# EasyEDA Pro project ProPrj_E24_5.0.epro, schematic 5.0

## Sheets
1 P1: Board Name: 5.0; Create Date: 2026-01-15; Page Name: P1; Project Name: E24_5.0; Schematic Name: 5.0; Update Date: 2026-01-15; Company: 嘉立创EDA; Page Size: A4; Version: V1.0
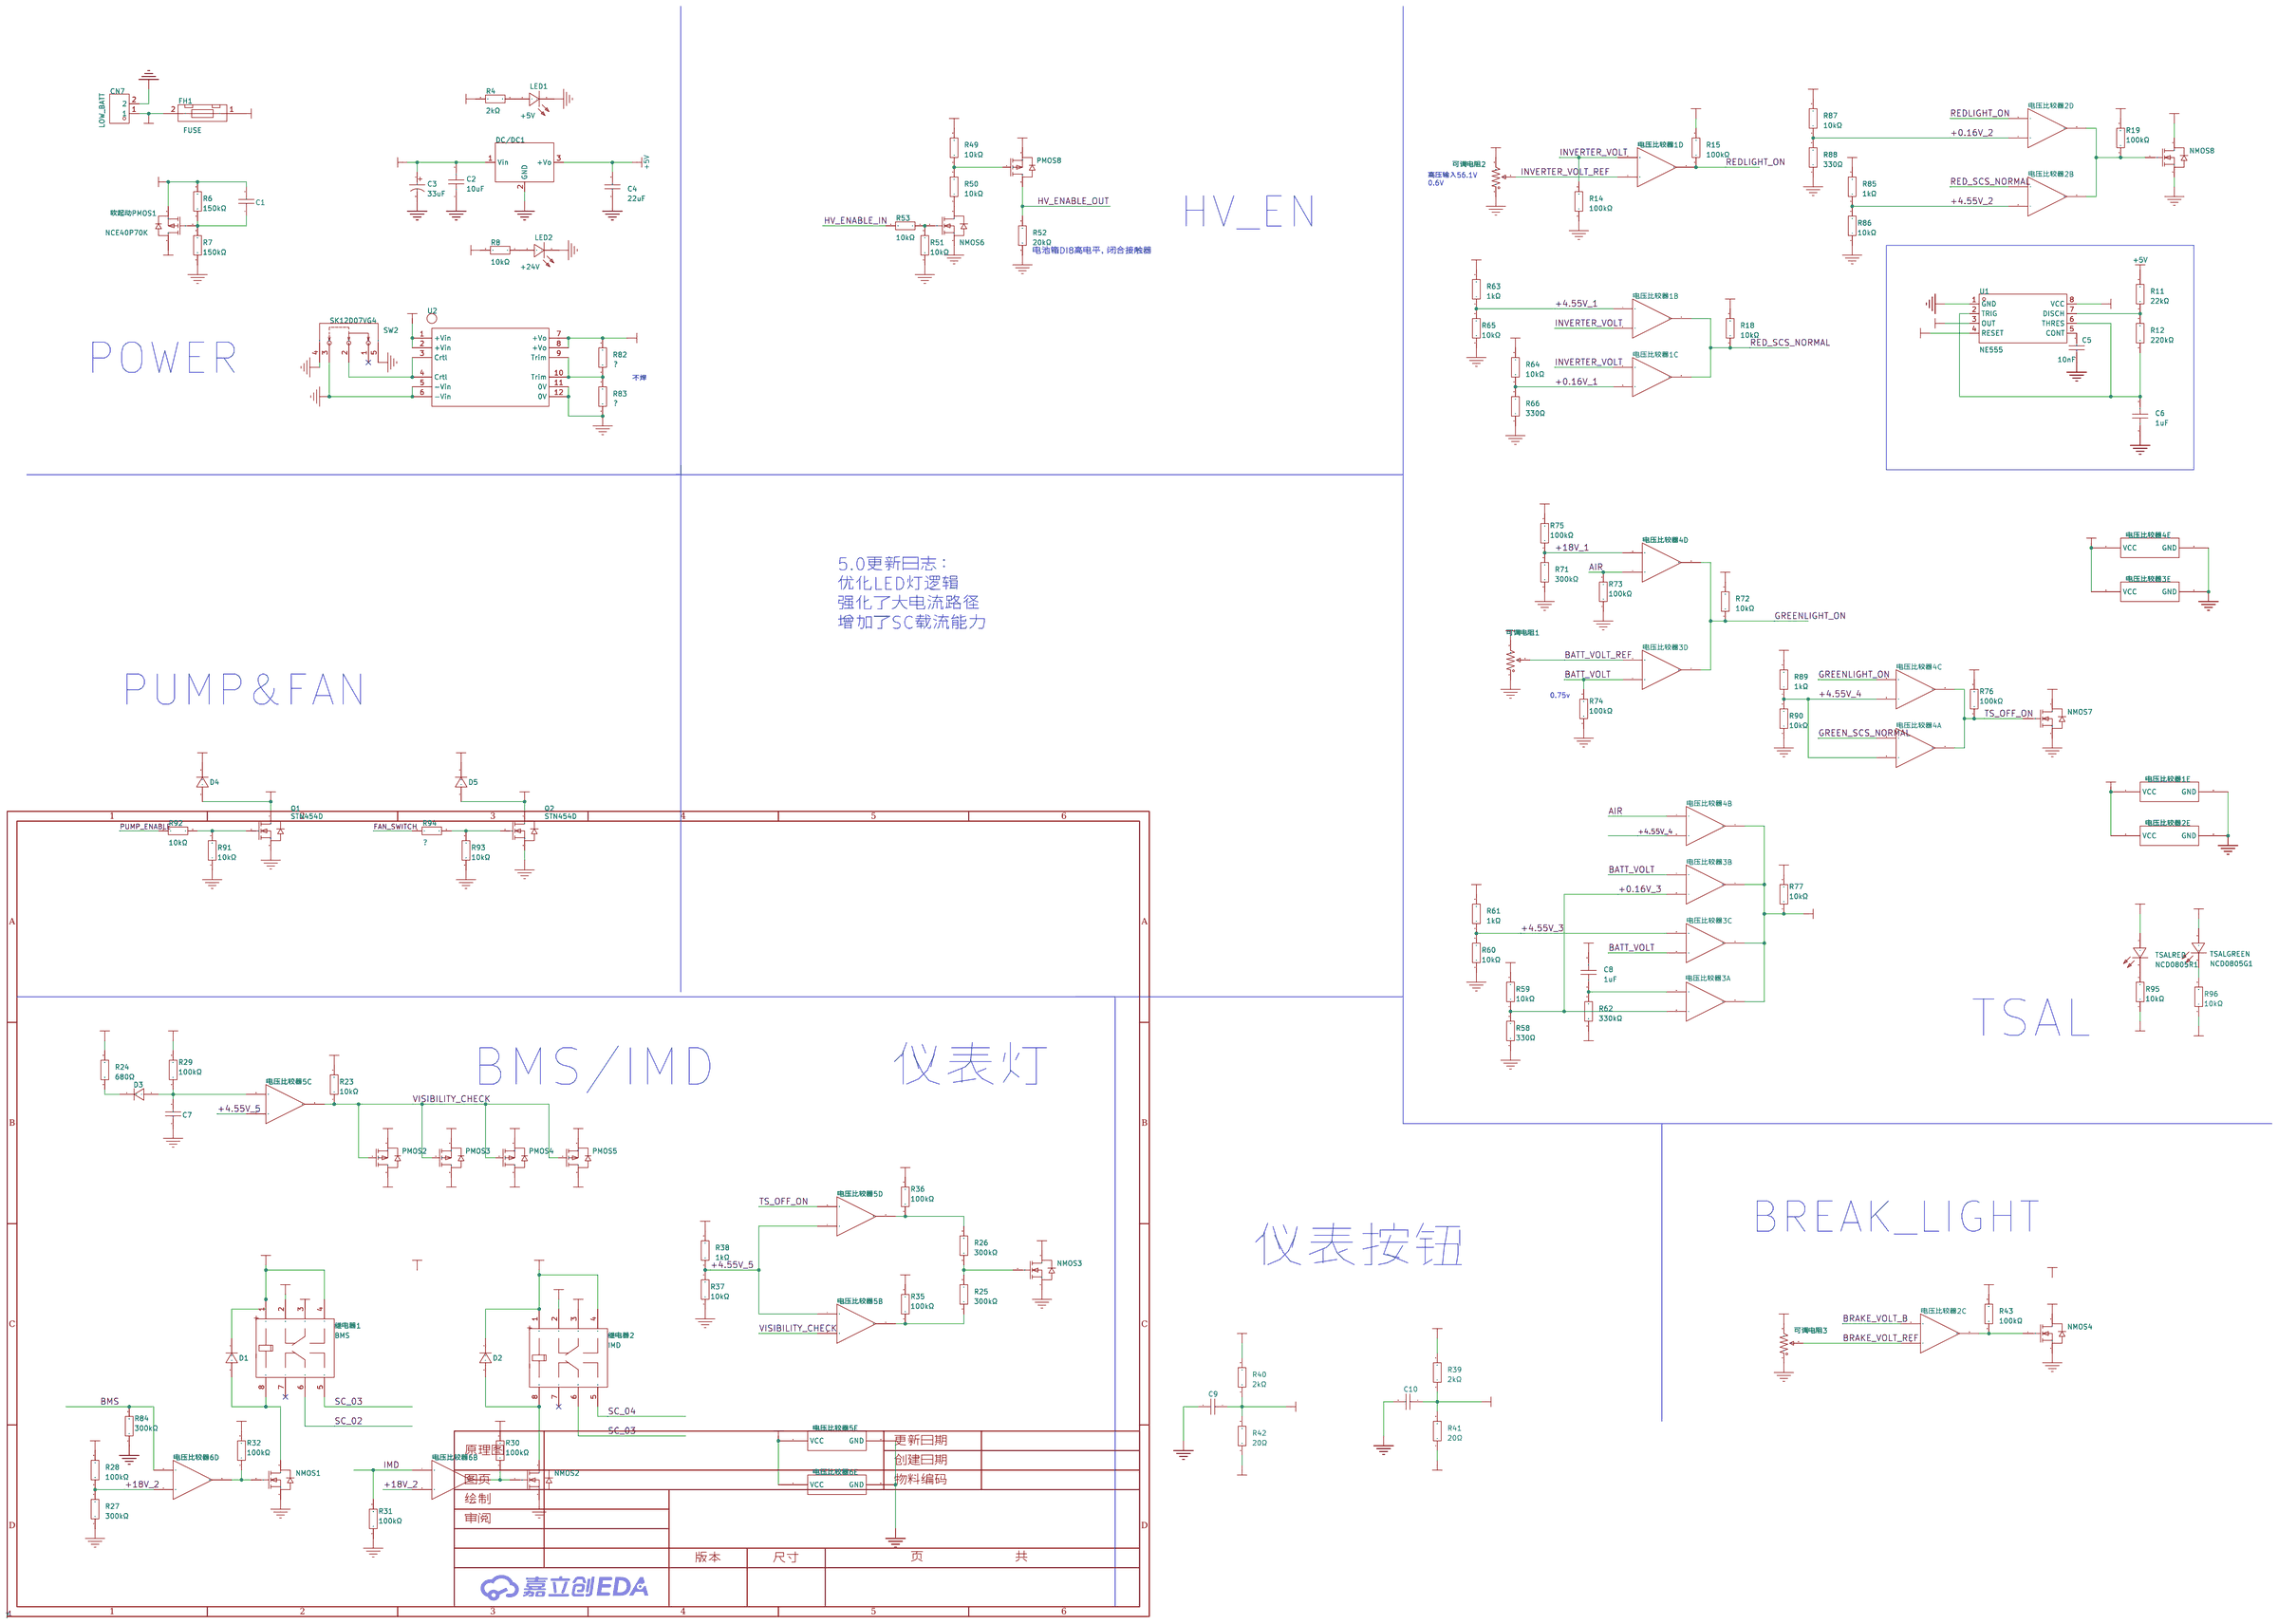
[diagram p0: P1]
2 P2: Create Date: 2025-09-20; Page Name: P2; Project Name: LV_E24; Schematic Name: 4.0_1; Update Date: 2025-09-20
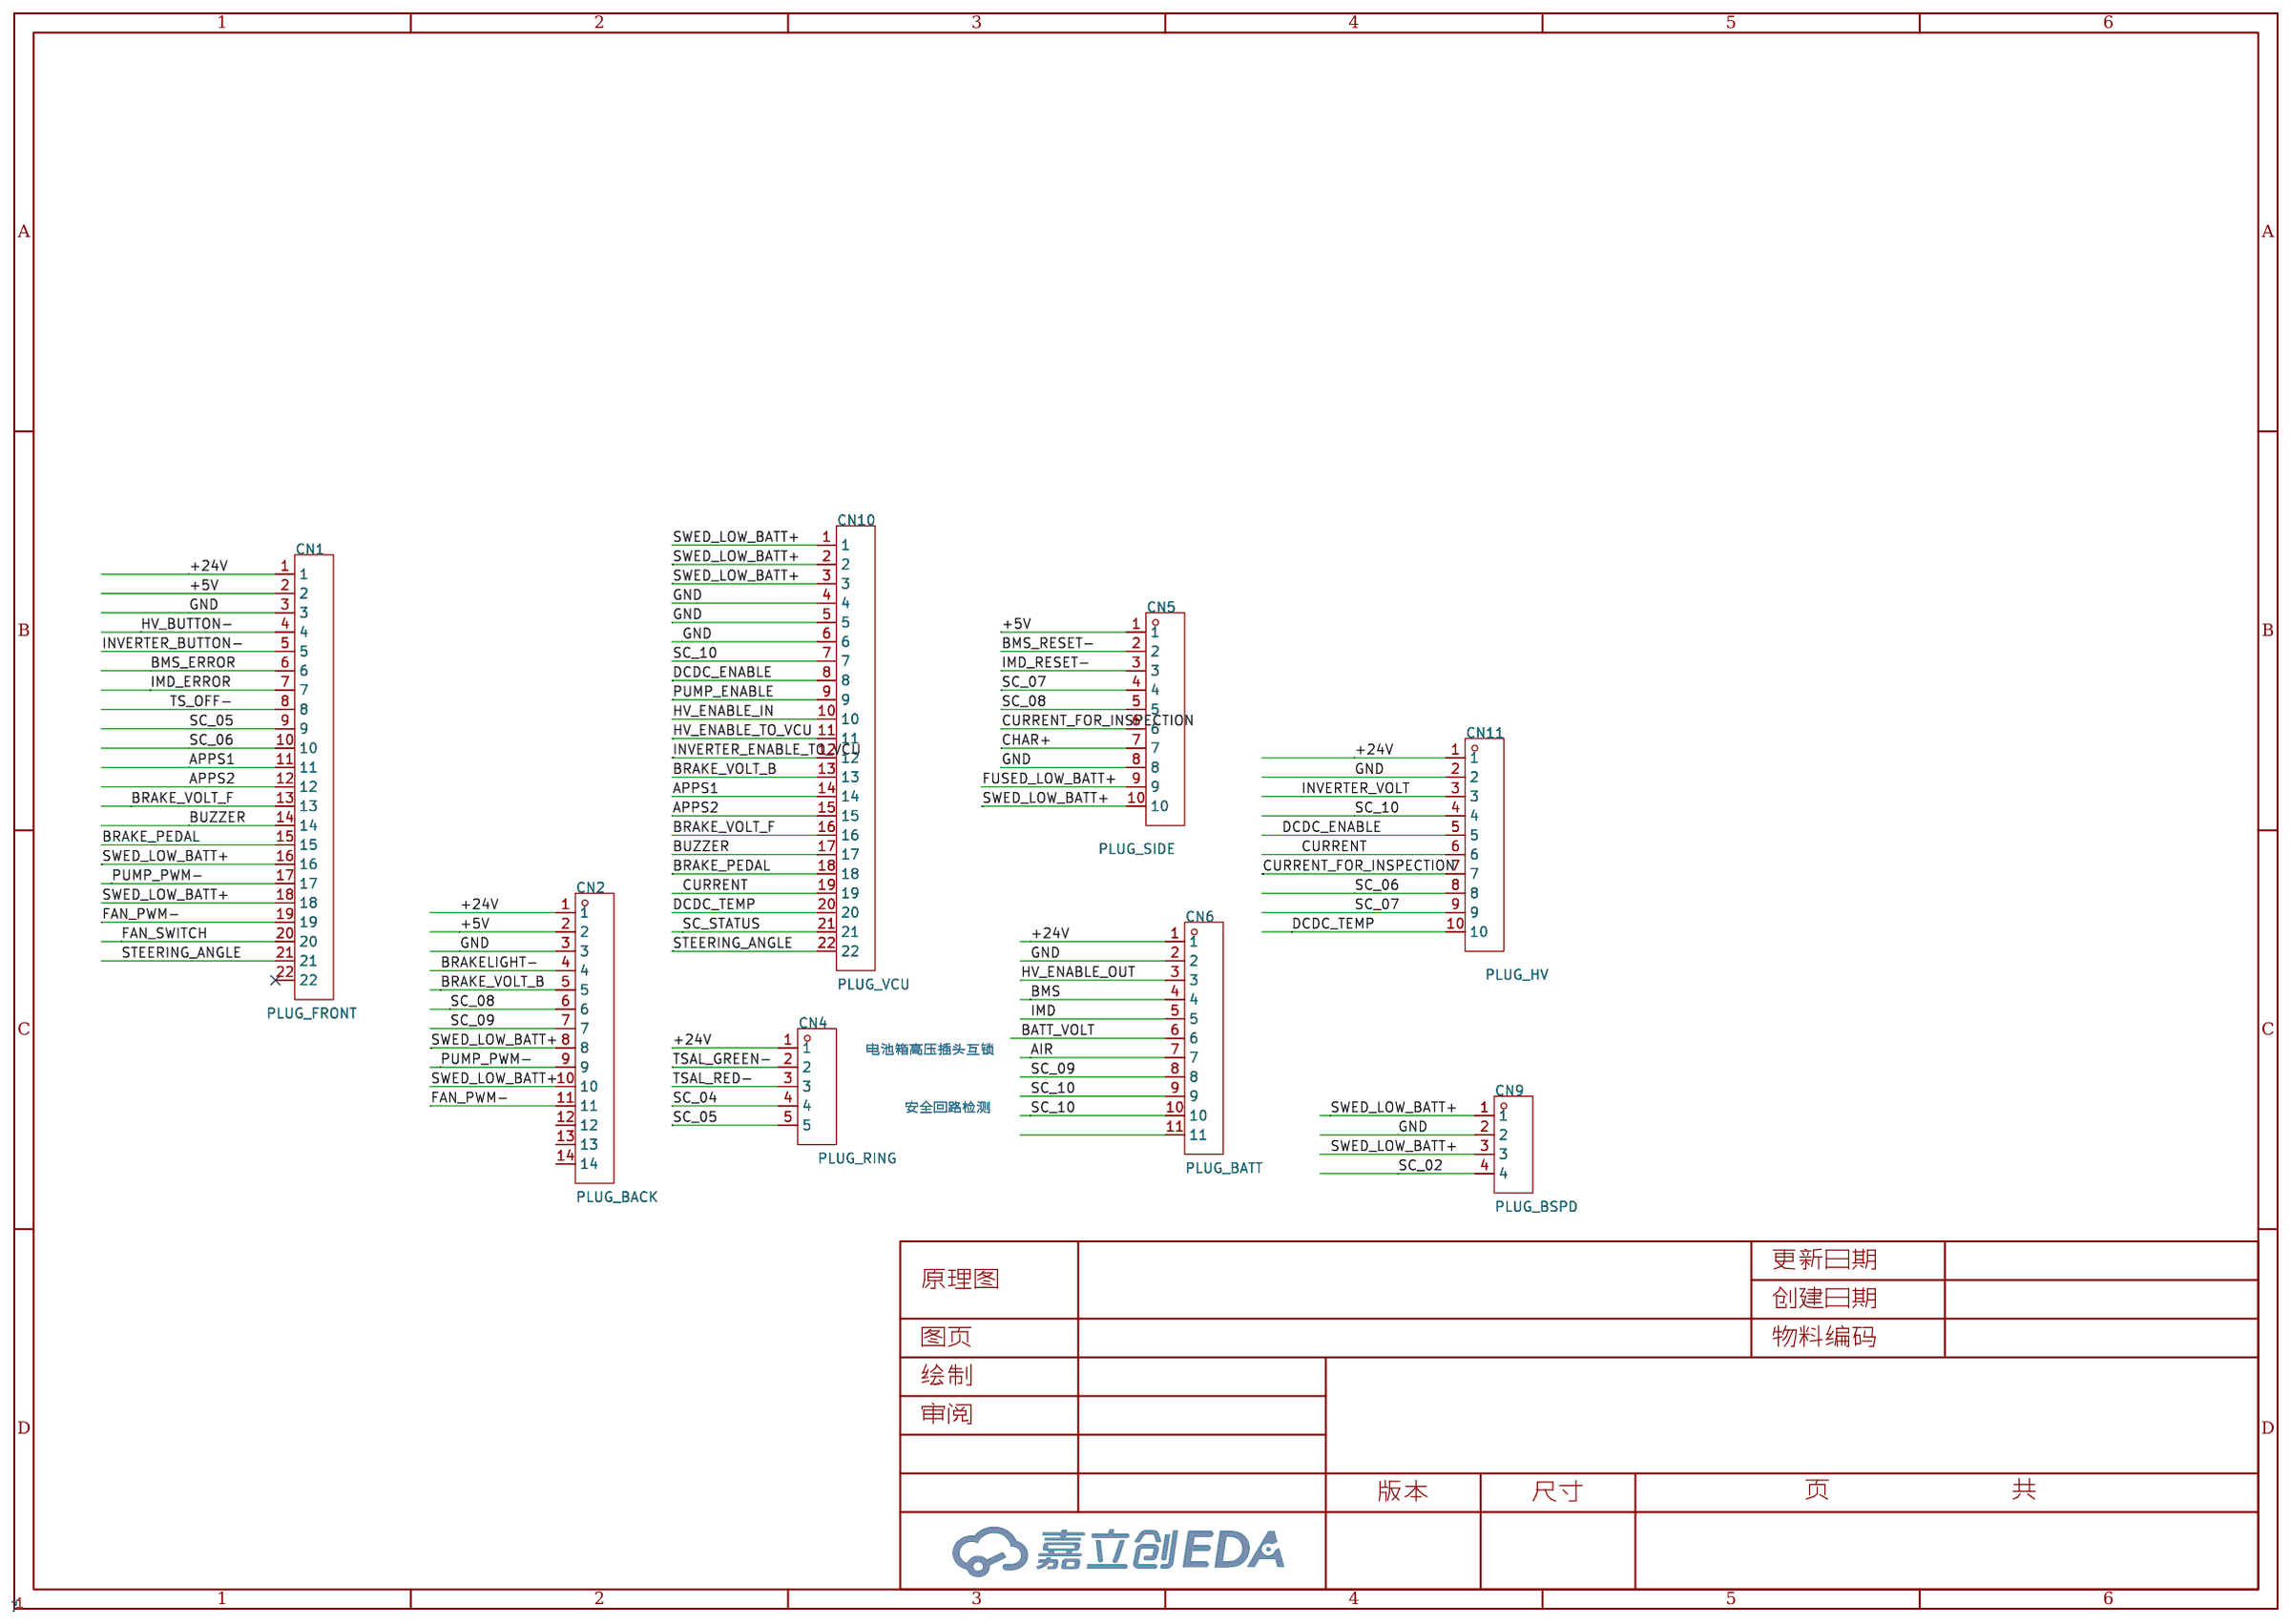
[diagram p1: P2]
3 P3: Create Date: 2025-09-20; Page Name: P3; Project Name: LV_E24; Update Date: 2025-10-22
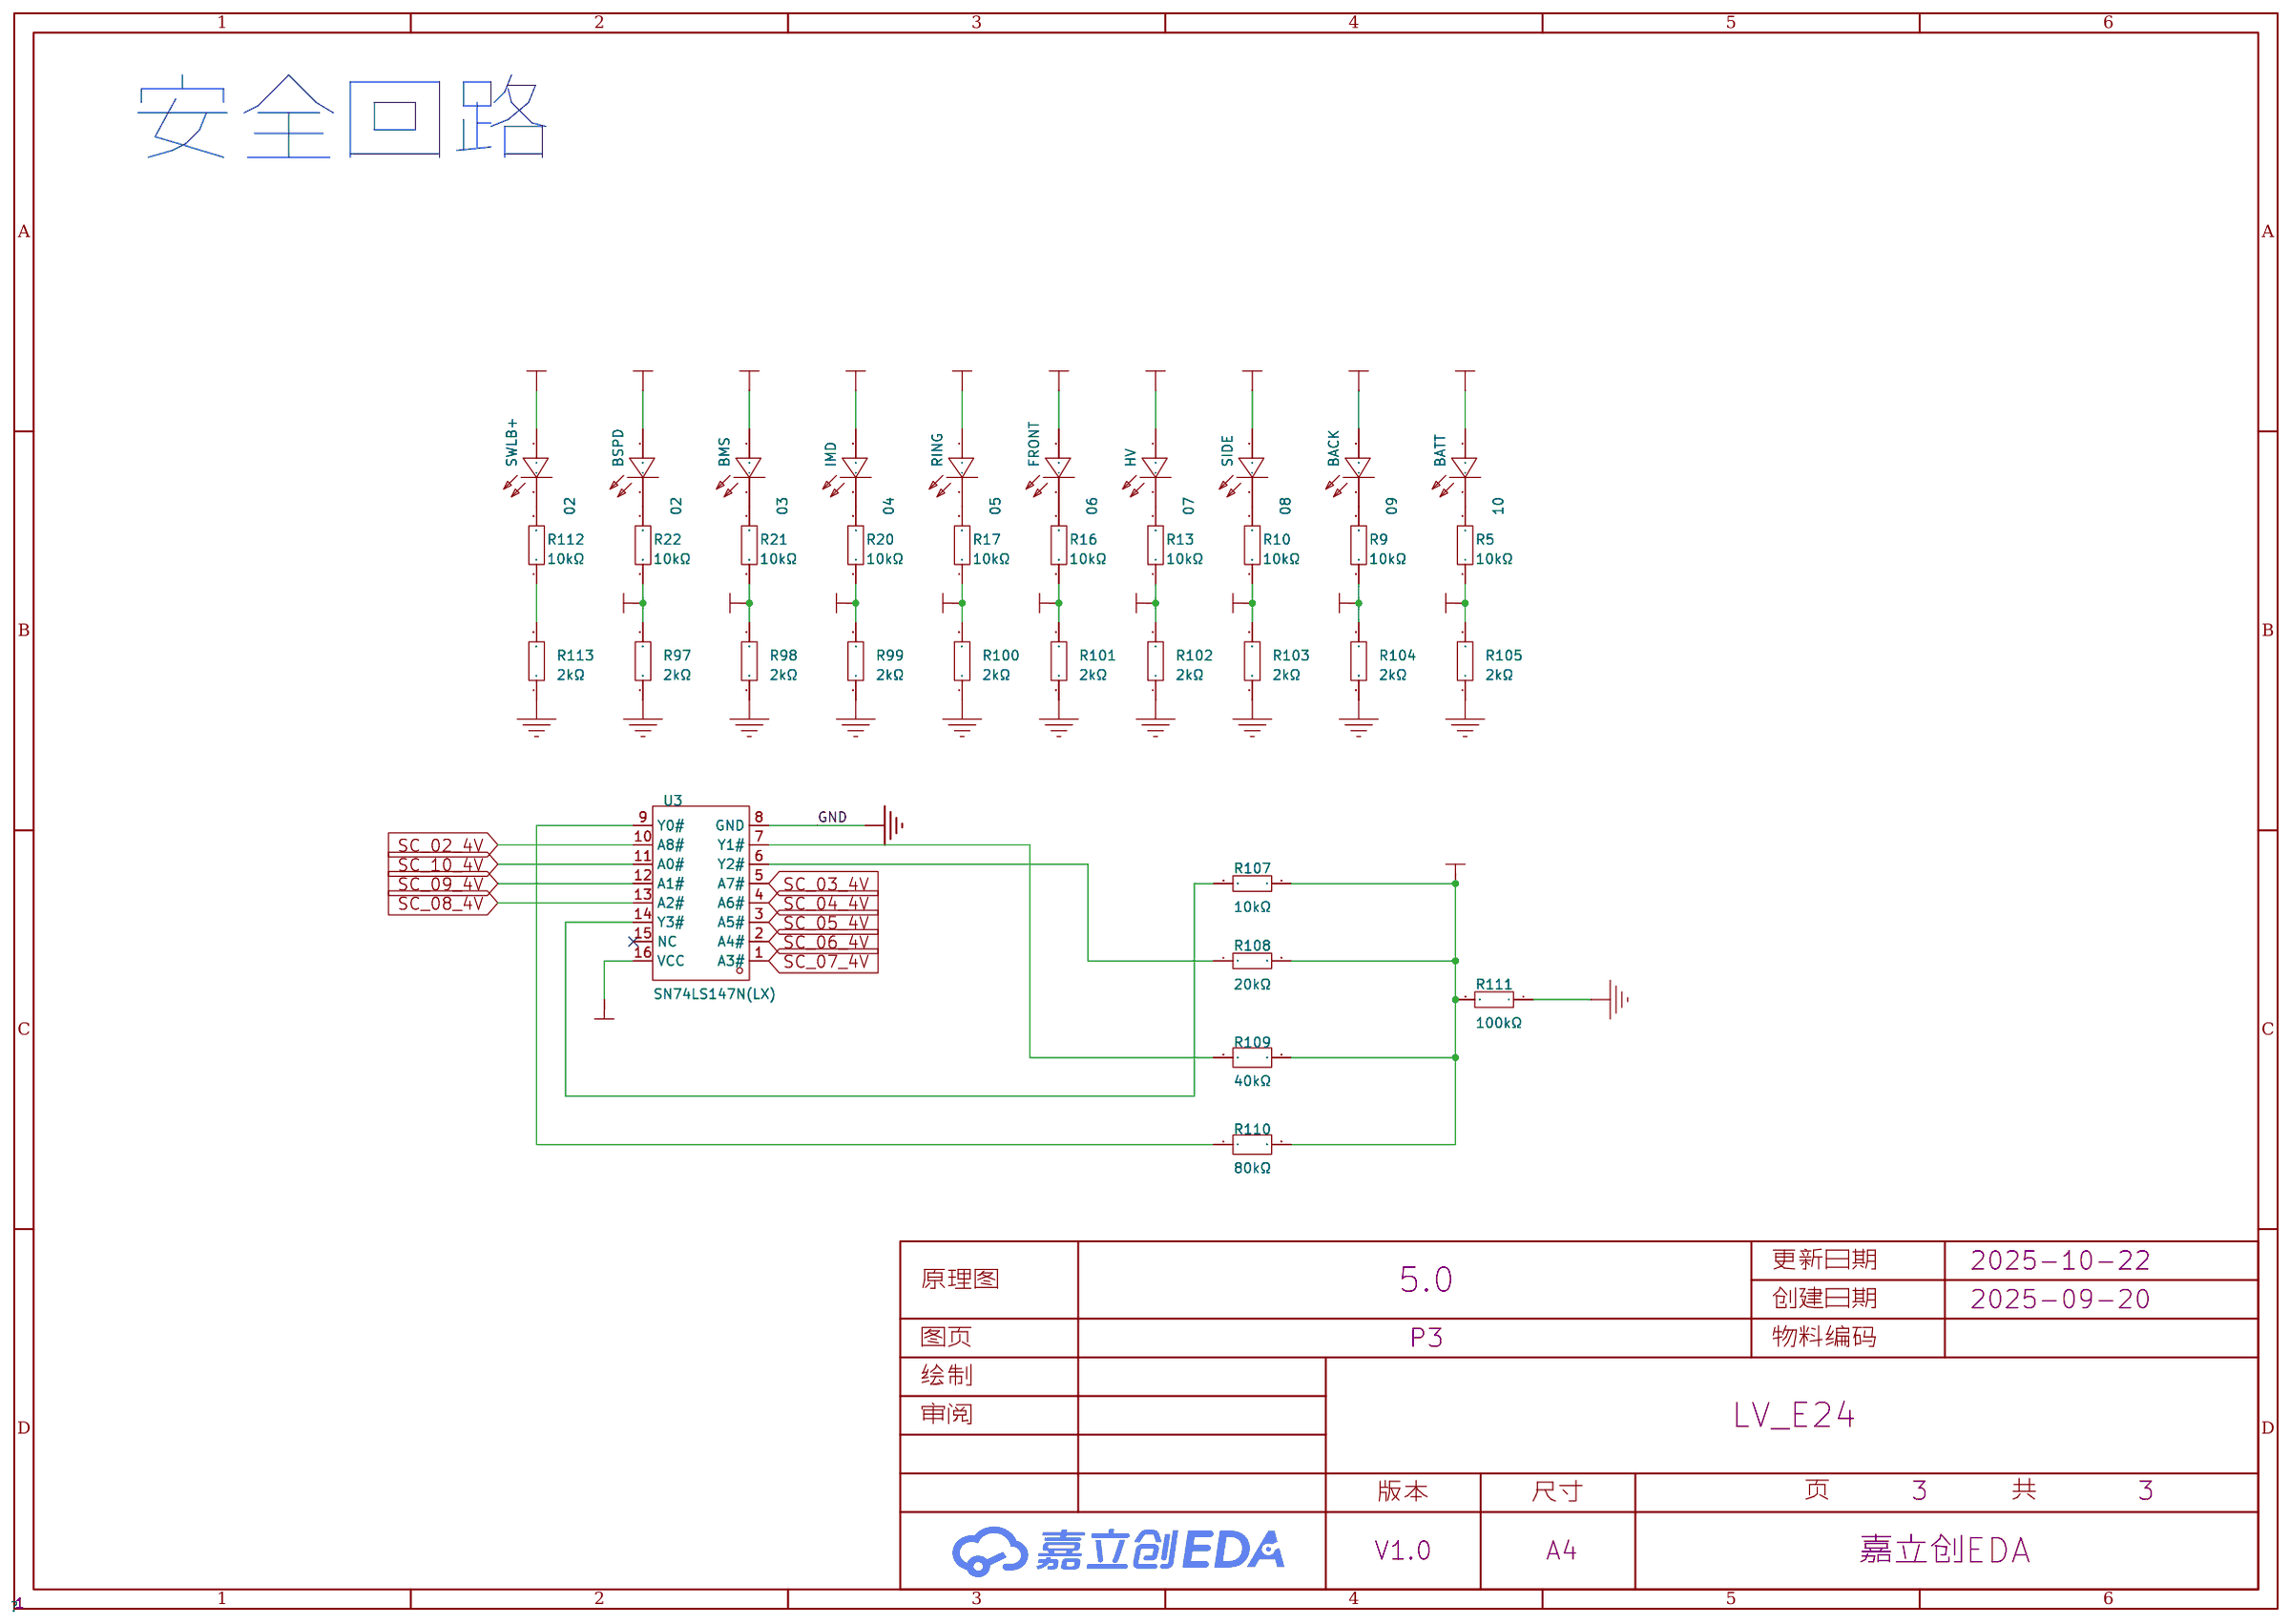
[diagram p2: P3]

## Parts
sheet P1
C1  10uF  [C0603]
C2  10uF  [C1206]
C3  33uF  [CAP-SMD_BD6.3-L6.6-W6.6-FD]
C4  22uF  [C0805]
C5  10nF  [C0603]
C6  1uF  [C0603]
C7  10uF  [C0603]
C8  1uF  [C0603]
C9  10uF  [C0603]
C10  10uF  [C0603]
CN7  LOW_BATT  [CONN-TH_2P-P3.81_DB2EVC-3.81-2P-BK]
D1  1N4148W  [SOD-123F_L2.7-W1.6-LS3.8-RD]
D2  1N4148W  [SOD-123F_L2.7-W1.6-LS3.8-RD]
D3  1N4148W  [SOD-123F_L2.7-W1.6-LS3.8-RD]
D4  SS54  [SMA_L4.4-W2.8-LS5.4-R-RD]
D5  SS54  [SMA_L4.4-W2.8-LS5.4-R-RD]
DC/DC1  K7805-2000R3  [PWRM-TH_DEXU_K78XX-2000R3]
FH1  FUSE  [FUSE-TH_XF-506P]
LED1  +5V  [LED0805-R-RD_BLUE]
LED2  +24V  [LED0805-R-RD_BLUE]
NMOS1  2N7002  [SOT-23-3_L2.9-W1.3-P1.90-LS2.4-BR]
NMOS2  2N7002  [SOT-23-3_L2.9-W1.3-P1.90-LS2.4-BR]
NMOS3  2N7002  [SOT-23-3_L2.9-W1.3-P1.90-LS2.4-BR]
NMOS4  WST4040  [SOT-23-3_L2.9-W1.6-P1.90-LS2.8-BR]
NMOS6  2N7002  [SOT-23-3_L2.9-W1.3-P1.90-LS2.4-BR]
NMOS7  WST4040  [SOT-23-3_L2.9-W1.6-P1.90-LS2.8-BR]
NMOS8  WST4040  [SOT-23-3_L2.9-W1.6-P1.90-LS2.8-BR]
PMOS2  LBSS84LT1G  [SOT-23_L2.9-W1.3-P1.90-LS2.4-BR]
PMOS3  LBSS84LT1G  [SOT-23_L2.9-W1.3-P1.90-LS2.4-BR]
PMOS4  LBSS84LT1G  [SOT-23_L2.9-W1.3-P1.90-LS2.4-BR]
PMOS5  LBSS84LT1G  [SOT-23_L2.9-W1.3-P1.90-LS2.4-BR]
PMOS8  LBSS84LT1G  [SOT-23_L2.9-W1.3-P1.90-LS2.4-BR]
Q1  STN454D  [TO-252-2_L6.5-W6.1-P4.58-LS10.0-BR]
Q2  STN454D  [TO-252-2_L6.5-W6.1-P4.58-LS10.0-BR]
R4  2kΩ  [R0603]
R6  150kΩ  [R0603]
R7  150kΩ  [R0603]
R8  10kΩ  [R0603]
R11  22kΩ  [R0603]
R12  220kΩ  [R0603]
R14  100kΩ  [R0603]
R15  100kΩ  [R0603]
R18  10kΩ  [R0603]
R19  100kΩ  [R0603]
R23  10kΩ  [R0603]
R24  680Ω  [R0603]
R25  300kΩ  [R0603]
R26  300kΩ  [R0603]
R27  300kΩ  [R0603]
R28  100kΩ  [R0603]
R29  100kΩ  [R0603]
R30  100kΩ  [R0603]
R31  100kΩ  [R0603]
R32  100kΩ  [R0603]
R35  100kΩ  [R0603]
R36  100kΩ  [R0603]
R37  10kΩ  [R0603]
R38  1kΩ  [R0603]
R39  2kΩ  [R0603]
R40  2kΩ  [R0603]
R41  20Ω  [R0603]
R42  20Ω  [R0603]
R43  100kΩ  [R0603]
R49  10kΩ  [R0603]
R50  10kΩ  [R0603]
R51  10kΩ  [R0603]
R52  20kΩ  [R0603]
R53  10kΩ  [R0603]
R58  330Ω  [R0603]
R59  10kΩ  [R0603]
R60  10kΩ  [R0603]
R61  1kΩ  [R0603]
R62  330kΩ  [R0603]
R63  1kΩ  [R0603]
R64  10kΩ  [R0603]
R65  10kΩ  [R0603]
R66  330Ω  [R0603]
R71  300kΩ  [R0603]
R72  10kΩ  [R0603]
R73  100kΩ  [R0603]
R74  100kΩ  [R0603]
R75  100kΩ  [R0603]
R76  100kΩ  [R0603]
R77  10kΩ  [R0603]
R82  ？  [R0603]
R83  ？  [R0603]
R84  300kΩ  [R0603]
R85  1kΩ  [R0603]
R86  10kΩ  [R0603]
R87  10kΩ  [R0603]
R88  330Ω  [R0603]
R89  1kΩ  [R0603]
R90  10kΩ  [R0603]
R91  10kΩ  [R0603]
R92  10kΩ  [R0603]
R93  10kΩ  [R0603]
R94  ？  [R0603]
R95  10kΩ  [R0603]
R96  10kΩ  [R0603]
SW2  SK12D07VG4  [SW-TH_SK12D07VG4]
TSALGREEN  NCD0805G1  [LED0805-R-RD]
TSALRED  NCD0805R1  [LED0805-R-RD]
U1  -  [SOIC-8_L4.9-W3.9-P1.27-LS6.0-BL]
U2  -  [DCDC_b_package]
可调电阻1  10kΩ  [RES-ADJ-TH_3P-L10.0-W10.0-P2.50-L]
可调电阻2  10kΩ  [RES-ADJ-TH_3P-L10.0-W10.0-P2.50-L]
可调电阻3  10kΩ  [RES-ADJ-TH_3P-L10.0-W10.0-P2.50-L]
电压比较器1  LM339PT  [TSSOP-14_L5.0-W4.4-P0.65-LS6.4-BL]  (sections 1,2,3,4)
电压比较器2  LM339PT  [TSSOP-14_L5.0-W4.4-P0.65-LS6.4-BL]  (sections 1,2,3,4)
电压比较器3  LM339PT  [TSSOP-14_L5.0-W4.4-P0.65-LS6.4-BL]  (sections 1,2,3,4,5)
电压比较器4  LM339PT  [TSSOP-14_L5.0-W4.4-P0.65-LS6.4-BL]  (sections 1,2,3,4,5)
电压比较器5  LM339PT  [TSSOP-14_L5.0-W4.4-P0.65-LS6.4-BL]  (sections 1,2,3,4)
电压比较器6  LM339PT  [TSSOP-14_L5.0-W4.4-P0.65-LS6.4-BL]  (sections 1,2,3)
继电器1  BMS  [RELAY-TH_HFDXXX]
继电器2  IMD  [RELAY-TH_HFDXXX]
软起动PMOS1  NCE40P70K  [TO-252-2_L6.6-W6.1-P4.57-LS9.9-TL-CW]
sheet P2
CN1  PLUG_FRONT  [CONN-TH_22P-P3.81_DB2EVC-3.81-22P-GN]
CN2  PLUG_BACK  [CONN-TH_14P-P3.81_DB2EVC-3.81-14P-GN]
CN4  PLUG_RING  [CONN-TH_5P-P3.81_DB2EVC-3.81-5P]
CN5  PLUG_SIDE  [CONN-TH_10P-P3.81_DB2EVC-3.81-10P]
CN6  PLUG_BATT  [CONN-TH_11P-P3.81_DB2EVC-3.81-11P-GN]
CN9  PLUG_BSPD  [CONN-TH_4P-P3.81_DB2EVC-3.81-4P]
CN10  PLUG_VCU  [CONN-TH_22P-P3.81_DB2EVC-3.81-22P-GN]
CN11  PLUG_HV  [CONN-TH_10P-P3.81_DB2EVC-3.81-10P]
sheet P3
BACK  09  [LED0805-R-RD]
BATT  10  [LED0805-R-RD]
BMS  03  [LED0805-R-RD]
BSPD  02  [LED0805-R-RD]
FRONT  06  [LED0805-R-RD]
HV  07  [LED0805-R-RD]
IMD  04  [LED0805-R-RD]
R5  10kΩ  [R0603]
R9  10kΩ  [R0603]
R10  10kΩ  [R0603]
R13  10kΩ  [R0603]
R16  10kΩ  [R0603]
R17  10kΩ  [R0603]
R20  10kΩ  [R0603]
R21  10kΩ  [R0603]
R22  10kΩ  [R0603]
R97  2kΩ  [R0603]
R98  2kΩ  [R0603]
R99  2kΩ  [R0603]
R100  2kΩ  [R0603]
R101  2kΩ  [R0603]
R102  2kΩ  [R0603]
R103  2kΩ  [R0603]
R104  2kΩ  [R0603]
R105  2kΩ  [R0603]
R107  10kΩ  [R0603]
R108  20kΩ  [R0603]
R109  40kΩ  [R0603]
R110  80kΩ  [R0603]
R111  100kΩ  [R0603]
R112  10kΩ  [R0603]
R113  2kΩ  [R0603]
RING  05  [LED0805-R-RD]
SIDE  08  [LED0805-R-RD]
SWLB+  02  [LED0805-R-RD]
U3  SN74LS147N(LX)  [PDIP-16_L19.3-W6.4-P2.54-LS7.94-BL]

## Library data of the parts
C1 C9 C10 = CL10A106MA8NRNC: 容值:10uF;精度:±20%;额定电压:25V;材质(温度系数):X5R;; LCSC Part Name: 10uF ±20% 25V; Supplier Part: C96446; Manufacturer: SAMSUNG(三星); Supplier Footprint: 0603; JLCPCB Part Class: Basic Part; Datasheet: https://atta.szlcsc.com/upload/public/pdf/source/20160218/1457707763339.pdf; Supplier: LCSC; Tolerance: ±20%; Voltage Rated: 25V; Temperature Coefficient: X5R; Design Item ID: C; Library Name: 器件原理图; Origin Footprint 2: C0805; Origin Footprint 3: C0402; Origin Footprint 4: C1206
C2 = CS3216X5R106K500NRI: 容值:10uF;精度:±10%;额定电压:50V;材质(温度系数):X5R;; LCSC Part Name: 10uF ±10% 50V; Supplier Part: C513774; Manufacturer: SAMWHA(三和); Supplier Footprint: 1206; JLCPCB Part Class: 扩展库; Datasheet: https://atta.szlcsc.com/upload/public/pdf/source/20200519/C513774_8E6AF19D7056FD60653684FA0E0AD594.pdf; Supplier: LCSC; Tolerance: ±10%; Voltage Rated: 50V; Temperature Coefficient: X5R
C3 = RVT1V330M0605: 容值:33uF;精度:±20%;额定电压:35V;纹波电流:41mA@120Hz;等效串联电阻:-;; LCSC Part Name: 33uF ±20% 35V; Supplier Part: C72508; Manufacturer: ROQANG(容强); Supplier Footprint: SMD,D6.3xL5.4mm; JLCPCB Part Class: 扩展库; Datasheet: https://atta.szlcsc.com/upload/public/pdf/source/20170325/1490427950282.pdf; Supplier: LCSC; Tolerance: ±20%; Rated Voltage: 35V; Ripple Current: 41mA@120Hz; φD: 6.3mm; L: 5.4mm; Lifetime @ Temp: 2000hrs@105℃; Operating Temperature: -40℃~+105℃
C4 = CL21A226MPQNNNE: 容值:22uF;精度:±20%;额定电压:10V;材质(温度系数):X5R;; LCSC Part Name: 22uF ±20% 10V; Supplier Part: C29277; Manufacturer: SAMSUNG(三星); Supplier Footprint: 0805; JLCPCB Part Class: 扩展库; Datasheet: https://atta.szlcsc.com/upload/public/pdf/source/20160218/1457707763339.pdf; Supplier: LCSC; Tolerance: ±20%; Voltage Rated: 10V; Temperature Coefficient: X5R
C5 = CC0603KRX7R9BB103: 容值:10nF;精度:±10%;额定电压:50V;材质(温度系数):X7R;; LCSC Part Name: 10nF ±10% 50V; Supplier Part: C100042; Manufacturer: YAGEO(国巨); Supplier Footprint: 0603; JLCPCB Part Class: 扩展库; Datasheet: https://atta.szlcsc.com/upload/public/pdf/source/20181008/C309510_22F155564471FAF6A489F7D68F34234E.pdf; Supplier: LCSC; Tolerance: ±10%; Voltage Rated: 50V; Temperature Coefficient: X7R
C6 C8 = CL10A105KB8NNNC: 容值:1uF;精度:±10%;额定电压:50V;材质(温度系数):X5R;; LCSC Part Name: 1uF ±10% 50V; Supplier Part: C15849; Manufacturer: SAMSUNG(三星); Supplier Footprint: 0603; JLCPCB Part Class: 基础库; Datasheet: https://atta.szlcsc.com/upload/public/pdf/source/20160218/1457707763339.pdf; Supplier: LCSC; Tolerance: ±10%; Voltage Rated: 50V; Temperature Coefficient: X5R
C7 = CL10A106KP8NNNC: 容值:10uF;精度:±10%;额定电压:10V;材质(温度系数):X5R;; LCSC Part Name: 10uF ±10% 10V; Supplier Part: C19702; Manufacturer: SAMSUNG(三星); Supplier Footprint: 0603; JLCPCB Part Class: Basic Part; Datasheet: https://atta.szlcsc.com/upload/public/pdf/source/20160218/1457707763339.pdf; Supplier: LCSC; Tolerance: ±10%; Voltage Rated: 10V; Temperature Coefficient: X5R; Design Item ID: C; Library Name: 器件原理图; Origin Footprint 2: C0805; Origin Footprint 3: C0402; Origin Footprint 4: C1206
CN7 = DB2EVC-3.81-2P-GN: 连接器类型:板端/插座-闭口;结构:1x2P;间距:3.81mm;颜色:绿色;安装方式:直针;排数:1;每排PIN数:2;额定电流:10A;额定电压:250V;工作温度范围:-40℃~+105℃;; LCSC Part Name: 3.81mm 1x2P 排数:1 每排P数:2; Supplier Part: C395686; Manufacturer: DORABO(地博电气); Supplier Footprint: 插件,P=3.81mm; JLCPCB Part Class: 扩展库; Datasheet: https://atta.szlcsc.com/upload/public/pdf/source/20230106/E295F87ABDAA44E449E4D4A582259339.pdf; Supplier: LCSC; Connector Type: 板端/插座-闭口; Structure: 1x2P; Pitch: 3.81mm; Color: 绿色; Mounting Style: 直针; Number of Pins: 2P; Number of Rows: 1; Number of PINs Per Row: 2; Current Rating (Max): 10A; Voltage Rating (Max): 250V; Operating Temperature Range: -40℃~+105℃; Standardization Check: false
D1-D3 = 1N4148W_C81598: 二极管配置:独立式;正向压降(Vf):1V@50mA;直流反向耐压(Vr):75V;平均整流电流(Io):150mA;功率:400mW;反向恢复时间(trr):4ns;; LCSC Part Name: 电压:75V 电流:150mA; Supplier Part: C81598; Manufacturer: ST(先科); Supplier Footprint: SOD-123; JLCPCB Part Class: Basic Part; Datasheet: https://atta.szlcsc.com/upload/public/pdf/source/20161024/1477288446905.pdf; Supplier: LCSC; Diode Configuration: 独立式; Forward Voltage (Vf@If): 1V@50mA; Reverse Voltage (Vr): 75V; Average Rectified Current (Io): 150mA; Power Dissipation: 400mW; Reverse Leakage Current: 1uA@75V; Reverse Recovery Time (trr): 4ns; Library Name: 器件原理图
D4 D5 = SS54_C22452: 正向压降(Vf):550mV@5A;直流反向耐压(Vr):40V;平均整流电流(Io):5A;; LCSC Part Name: 电压:40V 电流:5A; Supplier Part: C22452; Manufacturer: MDD; Supplier Footprint: SMA(DO-214AC); JLCPCB Part Class: Basic Part; Datasheet: https://atta.szlcsc.com/upload/public/pdf/source/20230314/529CD85F9B31F69841D3A079BC07E377.pdf; Supplier: LCSC; Forward Voltage (Vf@If): 550mV@5A; Reverse Voltage (Vr): 40V; Average Rectified Current (Io): 5A; Reverse Leakage Current (Ir): 1mA@40V; Library Name: 器件原理图; Standardization Check: false
DC/DC1 = K7805-2000R3: 转换类型:DC-DC;输入电压(DC):24V;输出电压:5V;输出电流(最大值):2A;转换效率:89%；92%;; Supplier Part: C2931187; Manufacturer: DEXU(德旭电子); Supplier Footprint: 插件; JLCPCB Part Class: Extended Part; Datasheet: https://atta.szlcsc.com/upload/public/pdf/source/20211216/93891B8D5ABE1095C2F13297E154A908.pdf; Supplier: LCSC; Conversion Type: DC-DC; Input Voltage(DC): 24V; Output Voltage: 5V; Output Current (Max): 2A; Isolation or not: 非隔离; Output Channel: 1; Conversion Efficiency: 89%；92%; Maximum Capacitive Load: 1000uF; Library Name: 器件原理图; Standardization Check: false
FH1 = XF-506P: 保险丝座类型:-;电路数:-;保险丝类型:-;; LCSC Part Name: 小型汽车插片保险丝座 2P2PIN/位; Supplier Part: C492610; Manufacturer: XFCN(兴飞); Supplier Footprint: 插件; JLCPCB Part Class: 扩展库; Datasheet: https://atta.szlcsc.com/upload/public/pdf/source/20210803/DF0095FE142D3C1FC63058D966D7448A.pdf; Supplier: LCSC; Voltage Rating: 250V; Current Rating: 15A
LED1 LED2 = SZYY0805B: 发光颜色:蓝色;功率:100mW;正向电流:5mA;主波长:460nm~475nm;二极管配置:-;透镜颜色:无色透明透镜;色温:-;发光角度:120°;载带方式:-;工作温度:-40℃~+85℃;; LCSC Part Name: 蓝灯; Supplier Part: C434433; Manufacturer: yongyu(永裕光电); Supplier Footprint: 0805; JLCPCB Part Class: 扩展库; Datasheet: https://atta.szlcsc.com/upload/public/pdf/source/20191204/C434433_0B90CAB876449C52BDD12D5E48F83BBD.pdf; Supplier: LCSC; Emitted Color: 蓝色; Power Dissipation: 100mW; Forward Current: 5mA; Dominant Wavelength: 460nm~475nm; Peak Wavelength: 469nm; Lens Color: 无色透明透镜; Viewing Angle: 120°; Operating Temperature: -40℃~+85℃
NMOS1 = 2N7002_C8545: 类型:N沟道;漏源电压(Vdss):60V;连续漏极电流(Id):115mA;功率(Pd):200mW;导通电阻(RDS(on)@Vgs,Id):7.5Ω@10V,500mA;阈值电压(Vgs(th)@Id):2.5V@250uA;; LCSC Part Name: N沟道 耐压:60V 电流:115mA; Supplier Part: C8545; Manufacturer: CJ(江苏长电/长晶); Supplier Footprint: SOT-23; JLCPCB Part Class: Basic Part; Datasheet: https://atta.szlcsc.com/upload/public/pdf/source/20171228/C164913_15144413269051213916.pdf; Supplier: LCSC; Type: N沟道; Drain Source Voltage (Vdss): 60V; Continuous Drain Current (Id): 115mA; Power Dissipation (Pd): 200mW; Drain Source On Resistance (RDS(on)@Vgs,Id): 7.5Ω@10V,500mA; Gate Threshold Voltage (Vgs(th)@Id): 2.5V@250uA; Library Name: 器件原理图; Input Offset Voltage (Vos): 5mV; Input Bias Current (Ib): 250nA; Supply Voltage: 2V~32V；1V~16V; Output Type: 开集; Output Mode: MOS；DTL；TTL；CMOS；ECL; Supply Current: 1mA; Operating Temperature: 0℃~+70℃
NMOS2 NMOS3 NMOS6 = 2N7002_C8545: 类型:N沟道;漏源电压(Vdss):60V;连续漏极电流(Id):115mA;功率(Pd):200mW;导通电阻(RDS(on)@Vgs,Id):7.5Ω@10V,500mA;阈值电压(Vgs(th)@Id):2.5V@250uA;; LCSC Part Name: N沟道 耐压:60V 电流:115mA; Supplier Part: C8545; Manufacturer: CJ(江苏长电/长晶); Supplier Footprint: SOT-23; JLCPCB Part Class: Basic Part; Datasheet: https://atta.szlcsc.com/upload/public/pdf/source/20171228/C164913_15144413269051213916.pdf; Supplier: LCSC; Type: N沟道; Drain Source Voltage (Vdss): 60V; Continuous Drain Current (Id): 115mA; Power Dissipation (Pd): 200mW; Drain Source On Resistance (RDS(on)@Vgs,Id): 7.5Ω@10V,500mA; Gate Threshold Voltage (Vgs(th)@Id): 2.5V@250uA; Library Name: 器件原理图
NMOS4 NMOS7 NMOS8 = WST4040: 类型:1个N沟道;漏源电压(Vdss):40V;连续漏极电流(Id):5.8A;功率(Pd):1W;导通电阻(RDS(on)@Vgs,Id):50mΩ@10V,3A;阈值电压(Vgs(th)@Id):1.6V@250uA;; LCSC Part Name: 1个N沟道 耐压:40V 电流:5.8A; Supplier Part: C377863; Manufacturer: WINSOK(微硕); Supplier Footprint: SOT-23-3L; JLCPCB Part Class: Extended Part; Datasheet: https://atta.szlcsc.com/upload/public/pdf/source/20190305/C377863_9AD55E0C700F225214BE84ECC8BEBD12.pdf; Supplier: LCSC; Type: 1个N沟道; Drain Source Voltage (Vdss): 40V; Continuous Drain Current (Id): 5.8A; Power Dissipation (Pd): 1W; Drain Source On Resistance (RDS(on)@Vgs,Id): 50mΩ@10V,3A; Gate Threshold Voltage (Vgs(th)@Id): 1.6V@250uA; Library Name: 器件原理图
PMOS2-PMOS5 PMOS8 = LBSS84LT1G: 类型:1个P沟道;漏源电压(Vdss):50V;连续漏极电流(Id):130mA;功率(Pd):225mW;导通电阻(RDS(on)@Vgs,Id):10Ω@5V,100mA;阈值电压(Vgs(th)@Id):2V@250uA;; LCSC Part Name: 1个P沟道 耐压:50V 电流:130mA; Supplier Part: C8492; Manufacturer: LRC(乐山无线电); Supplier Footprint: SOT-23; JLCPCB Part Class: Extended Part; Datasheet: https://atta.szlcsc.com/upload/public/pdf/source/20131116/1457706660633.pdf; Supplier: LCSC; Type: 1个P沟道; Drain Source Voltage (Vdss): 50V; Continuous Drain Current (Id): 130mA; Power Dissipation (Pd): 225mW; Drain Source On Resistance (RDS(on)@Vgs,Id): 10Ω@5V,100mA; Gate Threshold Voltage (Vgs(th)@Id): 2V@250uA; Library Name: 器件原理图
Q1 Q2 = STN454D: 类型:1个N沟道;漏源电压(Vdss):40V;连续漏极电流(Id):10A;功率(Pd):50W;导通电阻(RDS(on)@Vgs,Id):-;阈值电压(Vgs(th)@Id):-;; LCSC Part Name: 1个N沟道 耐压:40V 电流:10A; Supplier Part: C2682819; Manufacturer: STANSON(司坦森); Supplier Footprint: TO-252-2; JLCPCB Part Class: 扩展库; Datasheet: https://atta.szlcsc.com/upload/public/pdf/source/20210105/C2682819_271E3CAD210AB2D5C4EBBC91723836BC.pdf; Supplier: LCSC; Type: 1个N沟道; Drain Source Voltage (Vdss): 40V; Continuous Drain Current (Id): 10A; Power Dissipation (Pd): 50W
R4 R39 R40 R97-R105 R113 = 0603WAF2001T5E: 电阻类型:厚膜电阻;阻值:2kΩ;精度:±1%;功率:100mW;最大工作电压:75V;温度系数:±100ppm/℃;; LCSC Part Name: 2kΩ ±1% 100mW 厚膜电阻; Supplier Part: C22975; Manufacturer: UNI-ROYAL(厚声); Supplier Footprint: 0603; JLCPCB Part Class: 基础库; Datasheet: https://atta.szlcsc.com/upload/public/pdf/source/20200306/C422600_1E6D84923E4A46A82E41ADD87F860B5C.pdf; Supplier: LCSC; Type: 厚膜电阻; Tolerance: ±1%; Power(Watts): 100mW; Overload Voltage (Max): 75V; Temperature Coefficient: ±100ppm/℃; Operating Temperature Range: -55℃~+155℃
R6 R7 = 0603WAF1503T5E: 电阻类型:厚膜电阻;阻值:150kΩ;精度:±1%;功率:100mW;最大工作电压:75V;温度系数:±100ppm/℃;; LCSC Part Name: 150kΩ ±1% 100mW 厚膜电阻; Supplier Part: C22807; Manufacturer: UNI-ROYAL(厚声); Supplier Footprint: 0603; JLCPCB Part Class: 基础库; Datasheet: https://atta.szlcsc.com/upload/public/pdf/source/20200306/C422600_1E6D84923E4A46A82E41ADD87F860B5C.pdf; Supplier: LCSC; Type: 厚膜电阻; Tolerance: ±1%; Power(Watts): 100mW; Overload Voltage (Max): 75V; Temperature Coefficient: ±100ppm/℃; Operating Temperature Range: -55℃~+155℃
R5 R8-R10 R13 R16-R18 R20-R23 R37 R49-R51 R53 R59 R60 R64 R65 R72 R77 R82 R83 R86 R87 R90-R96 R107 R112 = 0603WAF1002T5E: 电阻类型:厚膜电阻;阻值:10kΩ;精度:±1%;功率:100mW;最大工作电压:75V;温度系数:±100ppm/℃;; LCSC Part Name: 厚膜电阻 10kΩ ±1% 100mW; Supplier Part: C25804; Manufacturer: UNI-ROYAL(厚声); Supplier Footprint: 0603; JLCPCB Part Class: 基础库; Datasheet: https://atta.szlcsc.com/upload/public/pdf/source/20200306/C422600_1E6D84923E4A46A82E41ADD87F860B5C.pdf; Supplier: LCSC; Type: 厚膜电阻; Tolerance: ±1%; Power(Watts): 100mW; Overload Voltage (Max): 75V; Temperature Coefficient: ±100ppm/℃; Operating Temperature Range: -55℃~+155℃
R11 = 0603WAF2202T5E: 电阻类型:厚膜电阻;阻值:22kΩ;精度:±1%;功率:100mW;最大工作电压:75V;温度系数:±100ppm/℃;; LCSC Part Name: 22kΩ ±1% 100mW 厚膜电阻; Supplier Part: C31850; Manufacturer: UNI-ROYAL(厚声); Supplier Footprint: 0603; JLCPCB Part Class: 基础库; Datasheet: https://atta.szlcsc.com/upload/public/pdf/source/20200306/C422600_1E6D84923E4A46A82E41ADD87F860B5C.pdf; Supplier: LCSC; Type: 厚膜电阻; Tolerance: ±1%; Power(Watts): 100mW; Overload Voltage (Max): 75V; Temperature Coefficient: ±100ppm/℃; Operating Temperature Range: -55℃~+155℃
R12 = 0603WAF2203T5E: 电阻类型:厚膜电阻;阻值:220kΩ;精度:±1%;功率:100mW;最大工作电压:75V;温度系数:±100ppm/℃;; LCSC Part Name: 220kΩ ±1% 100mW 厚膜电阻; Supplier Part: C22961; Manufacturer: UNI-ROYAL(厚声); Supplier Footprint: 0603; JLCPCB Part Class: 基础库; Datasheet: https://atta.szlcsc.com/upload/public/pdf/source/20200306/C422600_1E6D84923E4A46A82E41ADD87F860B5C.pdf; Supplier: LCSC; Type: 厚膜电阻; Tolerance: ±1%; Power(Watts): 100mW; Overload Voltage (Max): 75V; Temperature Coefficient: ±100ppm/℃; Operating Temperature Range: -55℃~+155℃
R14 R15 R19 R28-R32 R35 R36 R43 R73-R76 R111 = 0603WAF1003T5E: 电阻类型:厚膜电阻;阻值:100kΩ;精度:±1%;功率:100mW;最大工作电压:75V;温度系数:±100ppm/℃;; LCSC Part Name: 100kΩ ±1% 100mW 厚膜电阻; Supplier Part: C25803; Manufacturer: UNI-ROYAL(厚声); Supplier Footprint: 0603; JLCPCB Part Class: 基础库; Datasheet: https://atta.szlcsc.com/upload/public/pdf/source/20200306/C422600_1E6D84923E4A46A82E41ADD87F860B5C.pdf; Supplier: LCSC; Type: 厚膜电阻; Tolerance: ±1%; Power(Watts): 100mW; Overload Voltage (Max): 75V; Temperature Coefficient: ±100ppm/℃; Operating Temperature Range: -55℃~+155℃
R24 = 0603WAF6800T5E: 电阻类型:厚膜电阻;阻值:680Ω;精度:±1%;功率:100mW;最大工作电压:75V;温度系数:±100ppm/℃;; LCSC Part Name: 680Ω ±1% 100mW 厚膜电阻; Supplier Part: C23228; Manufacturer: UNI-ROYAL(厚声); Supplier Footprint: 0603; JLCPCB Part Class: 基础库; Datasheet: https://atta.szlcsc.com/upload/public/pdf/source/20200306/C422600_1E6D84923E4A46A82E41ADD87F860B5C.pdf; Supplier: LCSC; Type: 厚膜电阻; Tolerance: ±1%; Power(Watts): 100mW; Overload Voltage (Max): 75V; Temperature Coefficient: ±100ppm/℃; Operating Temperature Range: -55℃~+155℃
R25-R27 R71 = 0603WAF3003T5E: 电阻类型:厚膜电阻;阻值:300kΩ;精度:±1%;功率:100mW;最大工作电压:75V;温度系数:±100ppm/℃;; LCSC Part Name: 300kΩ ±1% 100mW 厚膜电阻; Supplier Part: C23024; Manufacturer: UNI-ROYAL(厚声); Supplier Footprint: 0603; JLCPCB Part Class: 基础库; Datasheet: https://atta.szlcsc.com/upload/public/pdf/source/20200306/C422600_1E6D84923E4A46A82E41ADD87F860B5C.pdf; Supplier: LCSC; Type: 厚膜电阻; Tolerance: ±1%; Power(Watts): 100mW; Overload Voltage (Max): 75V; Temperature Coefficient: ±100ppm/℃; Operating Temperature Range: -55℃~+155℃
R38 R61 R63 R85 R89 = 0603WAF1001T5E: 电阻类型:厚膜电阻;阻值:1kΩ;精度:±1%;功率:100mW;最大工作电压:75V;温度系数:±100ppm/℃;; LCSC Part Name: 1kΩ ±1% 100mW 厚膜电阻; Supplier Part: C21190; Manufacturer: UNI-ROYAL(厚声); Supplier Footprint: 0603; JLCPCB Part Class: 基础库; Datasheet: https://atta.szlcsc.com/upload/public/pdf/source/20200306/C422600_1E6D84923E4A46A82E41ADD87F860B5C.pdf; Supplier: LCSC; Type: 厚膜电阻; Tolerance: ±1%; Power(Watts): 100mW; Overload Voltage (Max): 75V; Temperature Coefficient: ±100ppm/℃; Operating Temperature Range: -55℃~+155℃
R41 R42 = 0603WAF200JT5E: 电阻类型:厚膜电阻;阻值:20Ω;精度:±1%;功率:100mW;最大工作电压:75V;温度系数:±100ppm/℃;; LCSC Part Name: 20Ω ±1% 100mW 厚膜电阻; Supplier Part: C22950; Manufacturer: UNI-ROYAL(厚声); Supplier Footprint: 0603; JLCPCB Part Class: 基础库; Datasheet: https://atta.szlcsc.com/upload/public/pdf/source/20200306/C422600_1E6D84923E4A46A82E41ADD87F860B5C.pdf; Supplier: LCSC; Type: 厚膜电阻; Tolerance: ±1%; Power(Watts): 100mW; Overload Voltage (Max): 75V; Temperature Coefficient: ±100ppm/℃; Operating Temperature Range: -55℃~+155℃
R52 R108 = 0603WAF2002T5E: 电阻类型:厚膜电阻;阻值:20kΩ;精度:±1%;功率:100mW;最大工作电压:75V;温度系数:±100ppm/℃;; LCSC Part Name: 20kΩ ±1% 100mW 厚膜电阻; Supplier Part: C4184; Manufacturer: UNI-ROYAL(厚声); Supplier Footprint: 0603; JLCPCB Part Class: 基础库; Datasheet: https://atta.szlcsc.com/upload/public/pdf/source/20200306/C422600_1E6D84923E4A46A82E41ADD87F860B5C.pdf; Supplier: LCSC; Type: 厚膜电阻; Tolerance: ±1%; Power(Watts): 100mW; Overload Voltage (Max): 75V; Temperature Coefficient: ±100ppm/℃; Operating Temperature Range: -55℃~+155℃
R58 R66 R88 = 0603WAF3300T5E: 电阻类型:厚膜电阻;阻值:330Ω;精度:±1%;功率:100mW;最大工作电压:75V;温度系数:±100ppm/℃;; LCSC Part Name: 330Ω ±1% 100mW 厚膜电阻; Supplier Part: C23138; Manufacturer: UNI-ROYAL(厚声); Supplier Footprint: 0603; JLCPCB Part Class: 基础库; Datasheet: https://atta.szlcsc.com/upload/public/pdf/source/20200306/C422600_1E6D84923E4A46A82E41ADD87F860B5C.pdf; Supplier: LCSC; Type: 厚膜电阻; Tolerance: ±1%; Power(Watts): 100mW; Overload Voltage (Max): 75V; Temperature Coefficient: ±100ppm/℃; Operating Temperature Range: -55℃~+155℃
R62 = 0603WAF3303T5E: 电阻类型:厚膜电阻;阻值:330kΩ;精度:±1%;功率:100mW;最大工作电压:75V;温度系数:±100ppm/℃;; LCSC Part Name: 330kΩ ±1% 100mW 厚膜电阻; Supplier Part: C23137; Manufacturer: UNI-ROYAL(厚声); Supplier Footprint: 0603; JLCPCB Part Class: 基础库; Datasheet: https://atta.szlcsc.com/upload/public/pdf/source/20200306/C422600_1E6D84923E4A46A82E41ADD87F860B5C.pdf; Supplier: LCSC; Type: 厚膜电阻; Tolerance: ±1%; Power(Watts): 100mW; Overload Voltage (Max): 75V; Temperature Coefficient: ±100ppm/℃; Operating Temperature Range: -55℃~+155℃
R84 = 0603WAF3003T5E: 电阻类型:厚膜电阻;阻值:300kΩ;精度:±1%;功率:100mW;最大工作电压:75V;温度系数:±100ppm/℃;; LCSC Part Name: 300kΩ ±1% 100mW 厚膜电阻; Supplier Part: C23024; Manufacturer: UNI-ROYAL(厚声); Supplier Footprint: 0603; JLCPCB Part Class: Basic Part; Datasheet: https://atta.szlcsc.com/upload/public/pdf/source/20200306/C422600_1E6D84923E4A46A82E41ADD87F860B5C.pdf; Supplier: LCSC; Type: 厚膜电阻; Tolerance: ±1%; Power(Watts): 100mW; Overload Voltage (Max): 75V; Temperature Coefficient: ±100ppm/℃; Operating Temperature Range: -55℃~+155℃
SW2 = SK12D07VG4: 电路结构:单刀双掷;安装方式:-;额定电流(DC):500mA;额定电压(DC):50V;额定电流(AC):-;额定电压(AC):-;机械寿命:5千次;; LCSC Part Name: 3脚2档位 卧插 滑动开关; Supplier Part: C393937; Manufacturer: SHOU HAN(首韩); Supplier Footprint: 插件; JLCPCB Part Class: 扩展库; Datasheet: https://atta.szlcsc.com/upload/public/pdf/source/20190521/C393937_939FE26E571CC67D2D532E953108A1B0.pdf; Supplier: LCSC; Circuit: 单刀双掷; Actuator Style: 矩形柱状; Pin Style: PC引脚; Switch Height: 8.8mm; Current Rating (DC): 500mA; Voltage Rating (DC): 50V; Mechanical Life: 5千次
BACK BATT BMS BSPD FRONT HV IMD RING SIDE SWLB+ TSALGREEN = NCD0805G1: 发光颜色:翠绿色;正向电压(VF):2.5V~3.6V;功率:72mW;正向电流:5mA;主波长:525nm~537.5nm;透镜颜色:无色透明透镜;发光强度:180mcd~400mcd;发光角度:130°;工作温度:-30℃~+85℃;; Supplier Part: C84260; Manufacturer: 国星光电; Supplier Footprint: 0805; JLCPCB Part Class: 扩展库; Datasheet: https://atta.szlcsc.com/upload/public/pdf/source/20200820/C84260_AFC7BF57C6FBA034D182BB8D10A67EFE.pdf; Supplier: LCSC; Emitted Color: 翠绿色; Forward Voltage (VF): 2.5V~3.6V; Power Dissipation: 72mW; Forward Current: 5mA; Dominant Wavelength: 525nm~537.5nm; Lens Color: 无色透明透镜; Luminous Intensity: 180mcd~400mcd; Viewing Angle: 130°; Operating Temperature: -30℃~+85℃
TSALRED = NCD0805R1: 灯头类型:-;发光颜色:红色;正向电压(VF):1.6V~2.6V;功率:65mW;正向电流:20mA;主波长:615nm~630nm;二极管配置:独立二极管;透镜颜色:无色透明透镜;色温:-;发光强度:67mcd~195mcd;发光角度:130°;载带方式:-;工作温度:-30℃~+85℃;; Supplier Part: C84256; Manufacturer: 国星光电; Supplier Footprint: 0805; JLCPCB Part Class: 基础库; Datasheet: https://atta.szlcsc.com/upload/public/pdf/source/20200820/C84256_F0A75A43B3EAD75808600A0514C76B99.pdf; Supplier: LCSC; Emitted Color: 红色; Forward Voltage (VF): 1.6V~2.6V; Power Dissipation: 65mW; Forward Current: 20mA; Dominant Wavelength: 615nm~630nm; Diode Configuration: 独立二极管; Lens Color: 无色透明透镜; Luminous Intensity: 67mcd~195mcd; Viewing Angle: 130°; Operating Temperature: -30℃~+85℃
U1 = NE555_C5125085: 频率:-;是否可编程:-;重置时间:-;; LCSC Part Name: NE555; Supplier Part: C5125085; Manufacturer: IDCHIP(英锐芯); Manufacturer Part: NE555; Supplier Footprint: SOP-8; JLCPCB Part Class: 扩展库; Datasheet: https://atta.szlcsc.com/upload/public/pdf/source/20220809/79E25EAC0B22A7A3251D697544CF8E0B.pdf; Supplier: LCSC; Supply Voltage: 4.5V~15V; Supply Current: 220mA
U2 = DCDC_remade
可调电阻1-可调电阻3 = 3296W-1-103: 阻值:10kΩ;精度:±10%;; LCSC Part Name: 10kΩ ±10%; Supplier Part: C118954; Manufacturer: BOCHEN(博晨); Supplier Footprint: 插件; JLCPCB Part Class: Extended Part; Datasheet: https://atta.szlcsc.com/upload/public/pdf/source/20171114/C118954_15106326646611117443.pdf; Supplier: LCSC; Tolerance: ±10%; Library Name: 器件原理图
电压比较器1-电压比较器6 = LM339PT: 输入失调电压(Vos):5mV;输入偏置电流(Ib):250nA;; Supplier Part: C111179; Manufacturer: ST(意法半导体); Supplier Footprint: TSSOP-14; JLCPCB Part Class: Extended Part; Datasheet: https://atta.szlcsc.com/upload/public/pdf/source/20181030/C283323_01965803D03C52B8D5D374D61EEFE444.pdf; Supplier: LCSC; Input Offset Voltage (Vos): 5mV; Input Bias Current (Ib): 250nA; Supply Voltage: 2V~32V；1V~16V; Output Type: 开集; Output Mode: MOS；DTL；TTL；CMOS；ECL; Supply Current: 1mA; Operating Temperature: 0℃~+70℃; Library Name: 器件原理图
继电器1 继电器2 = HFD4/5: 线圈电压:5V;触点形式:两组转换:2C(双刀双掷-转换);触点容量(电阻负载):1A@30VDC；300mA@125VAC;最大切换电压:250V@AC；220V@DC;最大切换电流:2A;; LCSC Part Name: 超小型5V继电器 双刀双掷; Supplier Part: C23510; Manufacturer: HF(宏发); Supplier Footprint: DIP,6.5x10mm; JLCPCB Part Class: Extended Part; Datasheet: https://atta.szlcsc.com/upload/public/pdf/source/20190729/C390665_9F7E181D3821B0A9B6A96379D32A4DEC.pdf; Supplier: LCSC; Coil Voltage: 5V; Contact Form: 两组转换:2C(双刀双掷-转换); Pin Number: 8; Contact Rating: 1A@30VDC；300mA@125VAC; Maximum Switching Voltage: 250V@AC；220V@DC; Contact Material: AgNi+镀金; Coil Rated Power: 140mW; Coil Resistance: 178Ω; Maximum Switching Current: 2A; Operate Time: 3ms; Release Time: 3ms; Coil Type: 有极性-单线圈; Contact Resistance: 100mΩ; Operating Temperature: -40℃~+85℃; Library Name: 器件原理图
软起动PMOS1 = NCE40P70K: 类型:1个P沟道;漏源电压(Vdss):40V;连续漏极电流(Id):70A;功率(Pd):130W;导通电阻(RDS(on)@Vgs,Id):10mΩ@10V,20A;阈值电压(Vgs(th)@Id):2.5V@250uA;; LCSC Part Name: 1个P沟道 耐压:40V 电流:70A; Supplier Part: C130101; Manufacturer: NCE(无锡新洁能); Supplier Footprint: TO-252-2(DPAK); JLCPCB Part Class: 扩展库; Datasheet: https://atta.szlcsc.com/upload/public/pdf/source/20170919/C130101_1505787178833976874.pdf; Supplier: LCSC; Type: 1个P沟道; Drain Source Voltage (Vdss): 40V; Continuous Drain Current (Id): 70A; Power Dissipation (Pd): 130W; Drain Source On Resistance (RDS(on)@Vgs,Id): 10mΩ@10V,20A; Gate Threshold Voltage (Vgs(th)@Id): 2.5V@250uA
CN1 CN10 = DB2EVC-3.81-22P-GN: 连接器类型:板端/插座-闭口;结构:1x22P;间距:3.81mm;颜色:绿色;安装方式:直针;排数:1;每排PIN数:22;额定电流:10A;额定电压:250V;工作温度范围:-40℃~+105℃;; LCSC Part Name: 3.81mm 1x22P 排数:1 每排P数:22; Supplier Part: C430382; Manufacturer: DORABO(地博电气); Supplier Footprint: 插件,P=3.81mm; JLCPCB Part Class: 扩展库; Datasheet: https://atta.szlcsc.com/upload/public/pdf/source/20230106/E295F87ABDAA44E449E4D4A582259339.pdf; Supplier: LCSC; Connector Type: 板端/插座-闭口; Structure: 1x22P; Pitch: 3.81mm; Color: 绿色; Mounting Style: 直针; Number of Pins: 22P; Number of Rows: 1; Number of PINs Per Row: 22; Current Rating (Max): 10A; Voltage Rating (Max): 250V; Operating Temperature Range: -40℃~+105℃
CN2 = DB2EVC-3.81-14P-GN: 连接器类型:板端/插座-闭口;结构:1x14P;间距:3.81mm;颜色:绿色;安装方式:直针;排数:1;每排PIN数:14;额定电流:10A;额定电压:250V;工作温度范围:-40℃~+105℃;; LCSC Part Name: 3.81mm 1x14P 排数:1 每排P数:14; Supplier Part: C430356; Manufacturer: DORABO(地博电气); Supplier Footprint: 插件,P=3.81mm; JLCPCB Part Class: 扩展库; Datasheet: https://atta.szlcsc.com/upload/public/pdf/source/20230106/E295F87ABDAA44E449E4D4A582259339.pdf; Supplier: LCSC; Connector Type: 板端/插座-闭口; Structure: 1x14P; Pitch: 3.81mm; Color: 绿色; Mounting Style: 直针; Number of Pins: 14P; Number of Rows: 1; Number of PINs Per Row: 14; Current Rating (Max): 10A; Voltage Rating (Max): 250V; Operating Temperature Range: -40℃~+105℃
CN4 = DB2EVC-3.81-5P-GN: 连接器类型:板端/插座-闭口;结构:1x5P;间距:3.81mm;颜色:绿色;安装方式:直针;排数:1;每排PIN数:5;额定电流:10A;额定电压:250V;工作温度范围:-40℃~+105℃;; LCSC Part Name: 3.81mm 1x5P 排数:1 每排P数:5; Supplier Part: C395701; Manufacturer: DORABO(地博电气); Manufacturer Part: plug_ring; Supplier Footprint: 插件,P=3.81mm; JLCPCB Part Class: 扩展库; Datasheet: https://atta.szlcsc.com/upload/public/pdf/source/20230106/E295F87ABDAA44E449E4D4A582259339.pdf; Supplier: LCSC; Connector Type: 板端/插座-闭口; Structure: 1x5P; Pitch: 3.81mm; Color: 绿色; Mounting Style: 直针; Number of Pins: 5P; Number of Rows: 1; Number of PINs Per Row: 5; Current Rating (Max): 10A; Voltage Rating (Max): 250V; Operating Temperature Range: -40℃~+105℃
CN5 CN11 = DB2EVC-3.81-10P-GN: 连接器类型:板端/插座-闭口;结构:1x10P;间距:3.81mm;颜色:绿色;安装方式:直针;排数:1;每排PIN数:10;额定电流:10A;额定电压:250V;工作温度范围:-40℃~+105℃;; LCSC Part Name: 3.81mm 1x10P 排数:1 每排P数:10; Supplier Part: C395723; Manufacturer: DORABO(地博电气); Manufacturer Part: plug_side; Supplier Footprint: 插件,P=3.81mm; JLCPCB Part Class: 扩展库; Datasheet: https://atta.szlcsc.com/upload/public/pdf/source/20230106/E295F87ABDAA44E449E4D4A582259339.pdf; Supplier: LCSC; Connector Type: 板端/插座-闭口; Structure: 1x10P; Pitch: 3.81mm; Color: 绿色; Mounting Style: 直针; Number of Pins: 10P; Number of Rows: 1; Number of PINs Per Row: 10; Current Rating (Max): 10A; Voltage Rating (Max): 250V; Operating Temperature Range: -40℃~+105℃
CN6 = DB2EVC-3.81-11P-GN: 连接器类型:板端/插座-闭口;结构:1x11P;间距:3.81mm;颜色:绿色;安装方式:直针;排数:1;每排PIN数:11;额定电流:10A;额定电压:250V;工作温度范围:-40℃~+105℃;; LCSC Part Name: 3.81mm 1x11P 排数:1 每排P数:11; Supplier Part: C430348; Manufacturer: DORABO(地博电气); Supplier Footprint: 插件,P=3.81mm; JLCPCB Part Class: Extended Part; Datasheet: https://atta.szlcsc.com/upload/public/pdf/source/20230106/E295F87ABDAA44E449E4D4A582259339.pdf; Supplier: LCSC; Connector Type: 板端/插座-闭口; Structure: 1x11P; Pitch: 3.81mm; Color: 绿色; Mounting Style: 直针; Number of Pins: 11P; Number of Rows: 1; Number of PINs Per Row: 11; Current Rating (Max): 10A; Voltage Rating (Max): 250V; Operating Temperature Range: -40℃~+105℃
CN9 = DB2EVC-3.81-4P-GN: 连接器类型:板端/插座-闭口;结构:1x4P;间距:3.81mm;颜色:绿色;安装方式:直针;排数:1;每排PIN数:4;额定电流:10A;额定电压:250V;工作温度范围:-40℃~+105℃;; LCSC Part Name: 3.81mm 1x4P 排数:1 每排P数:4; Supplier Part: C395697; Manufacturer: DORABO(地博电气); Manufacturer Part: plug-bspd; Supplier Footprint: 插件,P=3.81mm; Datasheet: https://atta.szlcsc.com/upload/public/pdf/source/20230106/E295F87ABDAA44E449E4D4A582259339.pdf; Supplier: LCSC; Connector Type: 板端/插座-闭口; Structure: 1x4P; Pitch: 3.81mm; Color: 绿色; Mounting Style: 直针; Number of Pins: 4P; Number of Rows: 1; Number of PINs Per Row: 4; Current Rating (Max): 10A; Voltage Rating (Max): 250V; Operating Temperature Range: -40℃~+105℃
R109 = RT0603BRD0740KL: 电阻类型:薄膜电阻;阻值:40kΩ;精度:±0.1%;功率:100mW;温度系数:±25ppm/℃;; LCSC Part Name: 薄膜电阻 40kΩ ±0.1% 100mW; Supplier Part: C861392; Manufacturer: YAGEO(国巨); Supplier Footprint: 0603; JLCPCB Part Class: 扩展库; Datasheet: https://atta.szlcsc.com/upload/public/pdf/source/20200610/C326738_5639A9F1B6EB6E4AE2197577D3456E7F.pdf; Supplier: LCSC; Type: 薄膜电阻; Tolerance: ±0.1%; Power(Watts): 100mW; Temperature Coefficient: ±25ppm/℃; Operating Temperature Range: -55℃~+155℃
R110 = ARG03FTC8002N: 阻值:80kΩ;精度:±1%;功率:100mW;温度系数:±25ppm/℃;; LCSC Part Name: 80kΩ ±1% 100mW; Supplier Part: C3014409; Manufacturer: Viking(光颉); Supplier Footprint: 0603; JLCPCB Part Class: 扩展库; Datasheet: https://atta.szlcsc.com/upload/public/pdf/source/20200117/C485675_99063924B4564AF910B7BE66DA8EFA49.pdf; Supplier: LCSC; Tolerance: ±1%; Power(Watts): 100mW; Temperature Coefficient: ±25ppm/℃
U3 = SN74LS147N(LX): 供电电压:2V~6V;线路数:4~10;灌电流(IOL):5.2mA;拉电流(IOH):5.2mA;; LCSC Part Name: 集成电路; Supplier Part: C22384759; Manufacturer: LX(灵星芯微); Supplier Footprint: DIP-16; JLCPCB Part Class: 扩展库; Datasheet: https://atta.szlcsc.com/upload/public/pdf/source/20240417/03D0E24505C68DE9706B4DD8F8640D77.pdf; Supplier: LCSC; Type: 优先顺序编码器; Voltage Supply Source: 单电源; Supply Voltage: 2V~6V; Number of lines: 4~10; Sink Current: 5.2mA; Source Current: 5.2mA; Operating temperature: -40℃~+125℃

## Nets
+0.16V_1: R64.1 R66.2 电压比较器1.10(IN-)
+0.16V_2: R87.1 R88.2 电压比较器2.4(IN-)
+0.16V_3: R58.2 R59.1 电压比较器3.6(IN-) 电压比较器3.8(IN-)
+4.55V_1: R63.1 R65.2 电压比较器1.7(IN+)
+4.55V_2: R85.1 R86.2 电压比较器2.6(IN-)
+4.55V_3: R60.2 R61.1 电压比较器3.11(IN+)
+4.55V_4: R89.1 R90.2 电压比较器4.6(IN-) 电压比较器4.8(IN-) 电压比较器4.10(IN-)
+4.55V_5: R37.2 R38.1 电压比较器5.4(IN-) 电压比较器5.7(IN+) 电压比较器5.10(IN-)
+5V: C4.2 C8.2 CN1.2 CN2.2 CN5.1 DC/DC1.3(+Vo) PMOS2.2(S) PMOS3.2(S) PMOS4.2(S) PMOS5.2(S) R4.2 R11.2 R18.2 R19.2 R23.2 R24.2 R29.2 R30.2 R32.2 R35.2 R36.2 R38.2 R43.2 R59.2 R61.2 R63.2 R64.2 R72.2 R76.2 R77.2 R85.2 R87.2 R89.2 U1.4(RESET) U1.8(VCC) U3.16(VCC) 可调电阻1.3 可调电阻2.3 可调电阻3.3 继电器1.3 继电器2.3
+18V_1: R71.2 R75.1 电压比较器4.5(IN+)
+18V_2: R27.2 R28.1 电压比较器6.4(IN-) 电压比较器6.6(IN-)
+24V: CN1.1 CN2.1 CN4.1 CN6.1 CN11.1 PMOS8.2(S) R8.2 R28.2 R39.2 R40.2 R49.2 R75.2 R82.2 TSALGREEN.1(A) TSALRED.1(+) U2.7(+Vo) U2.8(+Vo) 电压比较器1.3(VCC) 电压比较器2.3(VCC) 电压比较器3.3(VCC) 电压比较器4.3(VCC) 电压比较器5.3(VCC) 电压比较器6.3(VCC)
GND: C2.1 C3.2 C4.1 C5.1 C6.1 C7.1 C9.2 C10.2 CN1.3 CN2.3 CN5.8 CN6.2 CN7.2 CN9.2 CN10.4 CN10.5 CN10.6 CN11.2 DC/DC1.2(GND) LED1.2(-) LED2.2(-) NMOS1.2(S) NMOS2.2(S) NMOS3.2(S) NMOS4.2(S) NMOS6.2(S) NMOS7.2(S) NMOS8.2(S) Q1.3(S) Q2.3(S) R7.1 R14.1 R27.1 R31.1 R37.1 R51.1 R52.1 R58.1 R60.1 R65.1 R66.1 R71.1 R73.1 R74.1 R83.1 R84.1 R86.1 R88.1 R90.1 R91.1 R93.1 R97.1 R98.1 R99.1 R100.1 R101.1 R102.1 R103.1 R104.1 R105.1 R111.1 R113.1 SW2.3 SW2.4 SW2.5 U1.1(GND) U2.5(-Vin) U2.6(-Vin) U2.11(0V) U2.12(0V) U3.8(GND) 可调电阻1.1 可调电阻2.1 可调电阻3.1 电压比较器1.12(GND) 电压比较器2.12(GND) 电压比较器3.12(GND) 电压比较器4.12(GND) 电压比较器5.12(GND) 电压比较器6.12(GND)
AIR: CN6.7 R73.2 电压比较器4.4(IN-) 电压比较器4.7(IN+)
APPS1: CN1.11 CN10.14
APPS2: CN1.12 CN10.15
BATT_VOLT: CN6.6 R74.2 电压比较器3.4(IN-) 电压比较器3.7(IN+) 电压比较器3.10(IN-)
BATT_VOLT_REF: 可调电阻1.2 电压比较器3.5(IN+)
BMS: CN6.4 R84.2 电压比较器6.5(IN+)
BMS_ERROR: CN1.6 PMOS2.3(D) 继电器1.2
BMS_RESET-: CN5.2 D1.1(C) PMOS4.3(D) 继电器1.1 继电器1.4
BRAKE_PEDAL: CN1.15 CN10.18
BRAKE_VOLT_B: CN2.5 CN10.13 电压比较器2.11(IN+)
BRAKE_VOLT_F: CN1.13 CN10.16
BRAKE_VOLT_REF: 可调电阻3.2 电压比较器2.10(IN-)
BRAKELIGHT-: CN2.4 NMOS4.3(D)
BUZZER: CN1.14 CN10.17
CHAR+: CN5.7
CLOCK: R15.2 U1.3(OUT)
CURRENT: CN10.19 CN11.6
CURRENT_FOR_INSPECTION: CN5.6 CN11.7
DCDC_ENABLE: CN10.8 CN11.5
DCDC_TEMP: CN10.20 CN11.10
FAN_PWM-: CN1.19 CN2.11 D5.2(A) Q2.4(D)
FAN_SWITCH: CN1.20 R94.2
FUSED_LOW_BATT+: CN5.9 FH1.1
GREEN_SCS_NORMAL: R62.1 R77.1 电压比较器3.1(OUT) 电压比较器3.13(OUT) 电压比较器3.14(OUT) 电压比较器4.1(OUT) 电压比较器4.9(IN+)
GREENLIGHT_ON: R72.1 电压比较器3.2(OUT) 电压比较器4.2(OUT) 电压比较器4.11(IN+)
HV_BUTTON-: CN1.4 R42.1
HV_ENABLE_IN: CN10.10 R53.2
HV_ENABLE_OUT: CN6.3 PMOS8.3(D) R52.2
HV_ENABLE_TO_VCU: C9.1 CN10.11 R40.1 R42.2
IMD: CN6.5 R31.2 电压比较器6.7(IN+)
IMD_ERROR: CN1.7 PMOS3.3(D) 继电器2.2
IMD_RESET-: CN5.3 D2.1(C) PMOS5.3(D) 继电器2.1 继电器2.4
INVERTER_BUTTON-: CN1.5 R41.1
INVERTER_ENABLE_TO_VCU: C10.1 CN10.12 R39.1 R41.2
INVERTER_VOLT: CN11.3 R14.2 电压比较器1.5(IN+) 电压比较器1.6(IN-) 电压比较器1.11(IN+)
INVERTER_VOLT_REF: 可调电阻2.2 电压比较器1.4(IN-)
LOW_BATT+: CN7.1 FH1.2
PUMP_ENABLE: CN10.9 R92.2
PUMP_PWM-: CN1.17 CN2.9 D4.2(A) Q1.4(D)
RED_SCS_NORMAL: R18.1 电压比较器1.1(OUT) 电压比较器1.13(OUT) 电压比较器2.7(IN+)
REDLIGHT_ON: R15.1 电压比较器1.2(OUT) 电压比较器2.5(IN+)
SC_02: BSPD.1(A) CN9.4 继电器1.6
SC_02_4V: R22.1 R97.2 U3.10(A8#)
SC_03: BMS.1(A) 继电器1.5 继电器2.6
SC_03_4V: R21.1 R98.2 U3.5(A7#)
SC_04: CN4.4 IMD.1(A) 继电器2.5
SC_04_4V: R20.1 R99.2 U3.4(A6#)
SC_05: CN1.9 CN4.5 RING.1(A)
SC_05_4V: R17.1 R100.2 U3.3(A5#)
SC_06: CN1.10 CN11.8 FRONT.1(A)
SC_06_4V: R16.1 R101.2 U3.2(A4#)
SC_07: CN5.4 CN11.9 HV.1(A)
SC_07_4V: R13.1 R102.2 U3.1(A3#)
SC_08: CN2.6 CN5.5 SIDE.1(A)
SC_08_4V: R10.1 R103.2 U3.13(A2#)
SC_09: BACK.1(A) CN2.7 CN6.8
SC_09_4V: R9.1 R104.2 U3.12(A1#)
SC_10: BATT.1(A) CN6.9 CN6.10 CN10.7 CN11.4
SC_10_4V: R5.1 R105.2 U3.11(A0#)
SC_STATUS: CN10.21 R107.1 R108.2 R109.2 R110.2 R111.2
SOFTED_LOW_BATT+: C2.2 C3.1 D4.1(C) D5.1(C) DC/DC1.1(Vin) U2.1(+Vin) U2.2(+Vin) 软起动PMOS1.2(D)
STEERING_ANGLE: CN1.21 CN10.22
SWED_LOW_BATT+: C1.2 CN1.16 CN1.18 CN2.8 CN2.10 CN5.10 CN9.1 CN9.3 CN10.1 CN10.2 CN10.3 R6.2 SWLB+.1(A) 软起动PMOS1.3(S)
TS_OFF-: CN1.8 NMOS3.3(D)
TS_OFF_ON: NMOS7.1(G) R76.1 电压比较器4.13(OUT) 电压比较器4.14(OUT) 电压比较器5.5(IN+)
TSAL_GREEN-: CN4.2 NMOS7.3(D) R96.1
TSAL_RED-: CN4.3 NMOS8.3(D) R95.1
VISIBILITY_CHECK: PMOS2.1(G) PMOS3.1(G) PMOS4.1(G) PMOS5.1(G) R23.1 电压比较器5.6(IN-) 电压比较器5.13(OUT)
$1N7046: PMOS8.1(G) R49.1 R50.2
$1N7051: NMOS6.1(G) R51.2 R53.1
$1N7055: NMOS6.3(D) R50.1
$1N7061: C5.2 U1.5(CONT)
$1N7065: R11.1 R12.2 U1.7(DISCH)
$1N7066: C6.2 R12.1 U1.2(TRIG) U1.6(THRES)
$1N7088: NMOS8.1(G) R19.1 电压比较器2.1(OUT) 电压比较器2.2(OUT)
$1N7125: C8.1 R62.2 电压比较器3.9(IN+)
$1N7168: Q1.1(G) R91.2 R92.1
$1N7173: Q2.1(G) R93.2 R94.1
$1N7180: C1.1 R6.1 R7.2 软起动PMOS1.1(G)
$1N7198: R82.1 R83.2 U2.9(Trim) U2.10(Trim)
$1N7199: SW2.2 U2.3(Crtl) U2.4(Crtl)
$1N7218: NMOS4.1(G) R43.1 电压比较器2.13(OUT)
$1N7224: NMOS1.1(G) R32.1 电压比较器6.2(OUT)
$1N7234: NMOS2.1(G) R30.1 电压比较器6.1(OUT)
$1N7244: D1.2(A) NMOS1.3(D) 继电器1.8
$1N7245: D2.2(A) NMOS2.3(D) 继电器2.8
$1N7257: NMOS3.1(G) R25.2 R26.1
$1N7258: R26.2 R36.1 电压比较器5.2(OUT)
$1N7259: R25.1 R35.1 电压比较器5.1(OUT)
$1N7273: C7.2 D3.2(A) R29.1 电压比较器5.11(IN+)
$1N7274: D3.1(C) R24.1
$1N7300: R96.2 TSALGREEN.2(K)
$1N33230: R95.2 TSALRED.2(-)
$1N45877: LED1.1(+) R4.1
$1N45932: LED2.1(+) R8.1
$3N1751: BSPD.2(K) R22.2
$3N1752: BMS.2(K) R21.2
$3N1753: IMD.2(K) R20.2
$3N1754: R17.2 RING.2(K)
$3N1755: FRONT.2(K) R16.2
$3N1756: HV.2(K) R13.2
$3N1757: R10.2 SIDE.2(K)
$3N1758: BACK.2(K) R9.2
$3N1759: BATT.2(K) R5.2
$3N1775: R110.1 U3.9(Y0#)
$3N1776: R109.1 U3.7(Y1#)
$3N1777: R108.1 U3.6(Y2#)
$3N1778: R107.2 U3.14(Y3#)
$3N6142: R112.2 SWLB+.2(K)
$3N6144: R112.1 R113.2

Not connected (* = marked no-connect by the designer): CN1 22*; CN2 12 13 14; CN6 11; SW2 1*; U3 15(NC)*; 继电器1 7*; 继电器2 7*

## Notes on the sheets
sheet 1
- 高压输入56.1V
  0.6V
- HV_EN
- 电池箱DI8高电平，闭合接触器
- POWER
- 不焊
- 5.0更新日志：
  优化LED灯逻辑
  强化了大电流路径
  增加了SC载流能力
- 0.75v
- PUMP&FAN
- TSAL
- BMS/IMD
- 仪表灯
- BREAK_LIGHT
- 仪表按钮
sheet 2
- 电池箱高压插头互锁
- 安全回路检测
sheet 3
- 安全回路
